# EAGLE design rgb-matrix-backpack-5 (EAGLE 6.5.0)

## Sheet 1 of 3
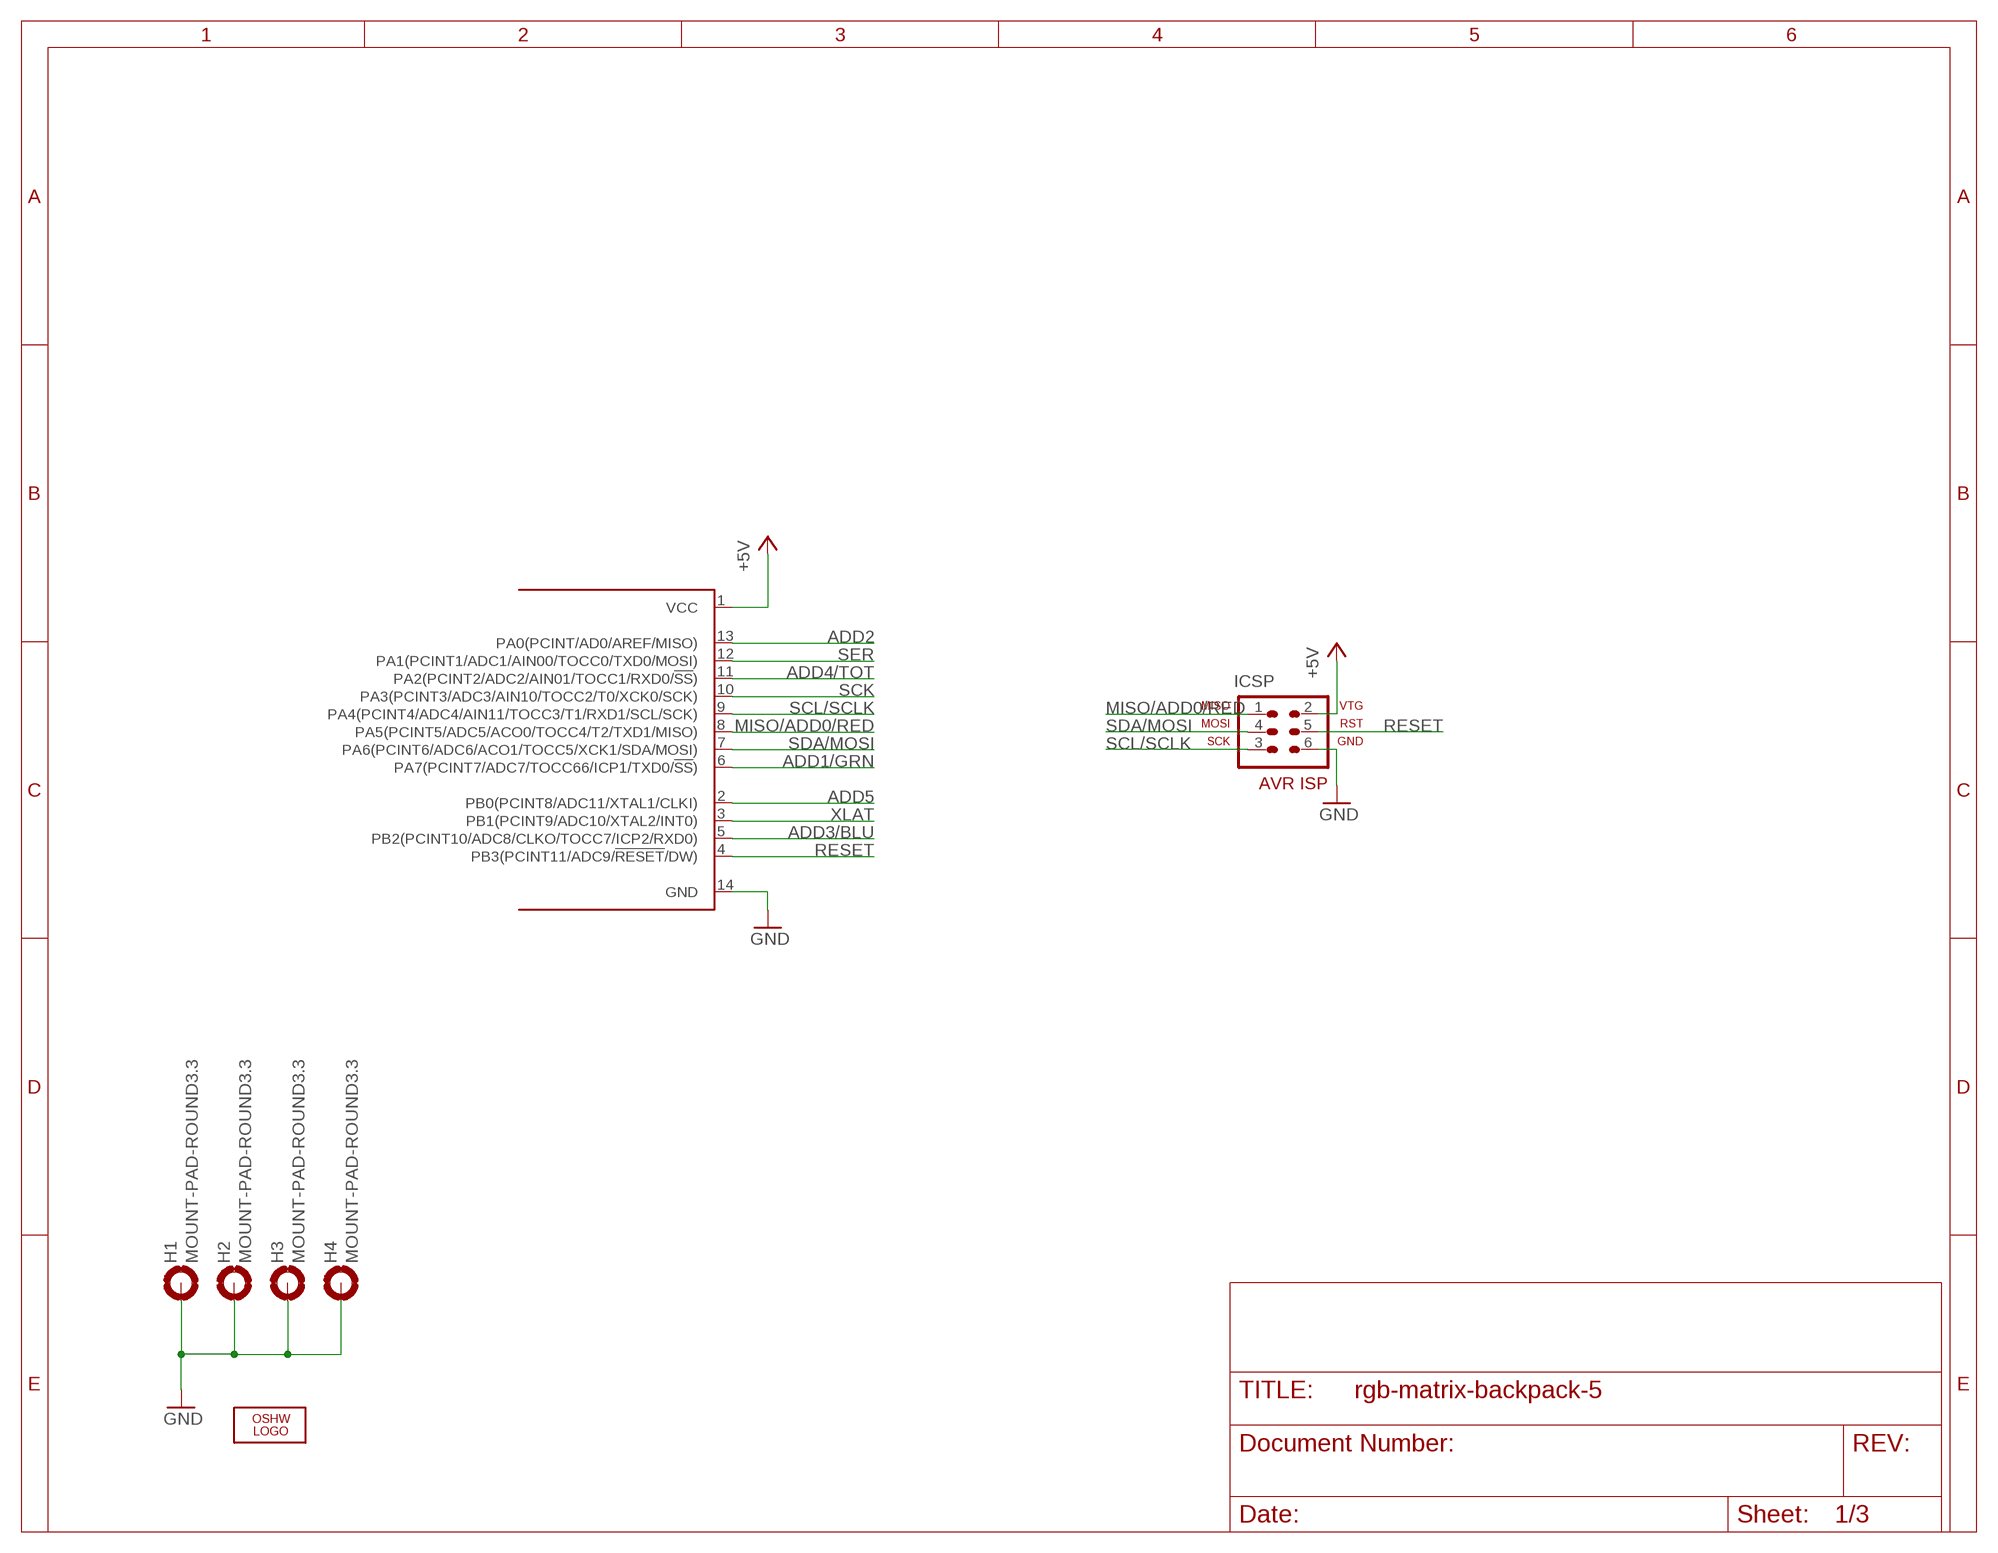
[diagram p0: schematic, sheet 1]

### Parts
H1  MOUNT-PAD-ROUND3.3  [3,3-PAD]
H2  MOUNT-PAD-ROUND3.3  [3,3-PAD]
H3  MOUNT-PAD-ROUND3.3  [3,3-PAD]
H4  MOUNT-PAD-ROUND3.3  [3,3-PAD]
ICSP  AVR-ISP-6  [AVR-ISP-6]
LOGO1  OSHW_LOGO_FILLX0350-NT  [OSHW_FILLX350_NOTEXT]
U1  ATTINY841-SU  [SO14]

### Nets
ADD1/GRN: U1.6(PA7(PCINT7/ADC7/TOCC66/ICP1/TXD0/!SS!)) ; also sheet 2,3
ADD2: U1.13(PA0(PCINT/AD0/AREF/MISO)) ; also sheet 2
ADD3/BLU: U1.5(PB2(PCINT10/ADC8/CLKO/TOCC7/ICP2/RXD0)) ; also sheet 2,3
ADD4/TOT: U1.11(PA2(PCINT2/ADC2/AIN01/TOCC1/RXD0/!SS!)) ; also sheet 2,3
ADD5: U1.2(PB0(PCINT8/ADC11/XTAL1/CLKI)) ; also sheet 2
GND [power]: H1.B3,3(MOUNT) H2.B3,3(MOUNT) H3.B3,3(MOUNT) H4.B3,3(MOUNT) ICSP.6 U1.14(GND) ; also sheet 2
MISO/ADD0/RED: ICSP.1 U1.8(PA5(PCINT5/ADC5/ACO0/TOCC4/T2/TXD1/MISO)) ; also sheet 2,3
RESET: ICSP.5 U1.4(PB3(PCINT11/ADC9/!RESET!/DW))
SCK: U1.10(PA3(PCINT3/ADC3/AIN10/TOCC2/T0/XCK0/SCK)) ; also sheet 3
SCL/SCLK: ICSP.3 U1.9(PA4(PCINT4/ADC4/AIN11/TOCC3/T1/RXD1/SCL/SCK)) ; also sheet 2
SDA/MOSI: ICSP.4 U1.7(PA6(PCINT6/ADC6/ACO1/TOCC5/XCK1/SDA/MOSI)) ; also sheet 2
SER: U1.12(PA1(PCINT1/ADC1/AIN00/TOCC0/TXD0/MOSI)) ; also sheet 3
VCC [power]: ICSP.2 U1.1(VCC) ; supply symbol labelled +5V ; also sheet 2,3
XLAT: U1.3(PB1(PCINT9/ADC10/XTAL2/INT0)) ; also sheet 3

## Sheet 2 of 3
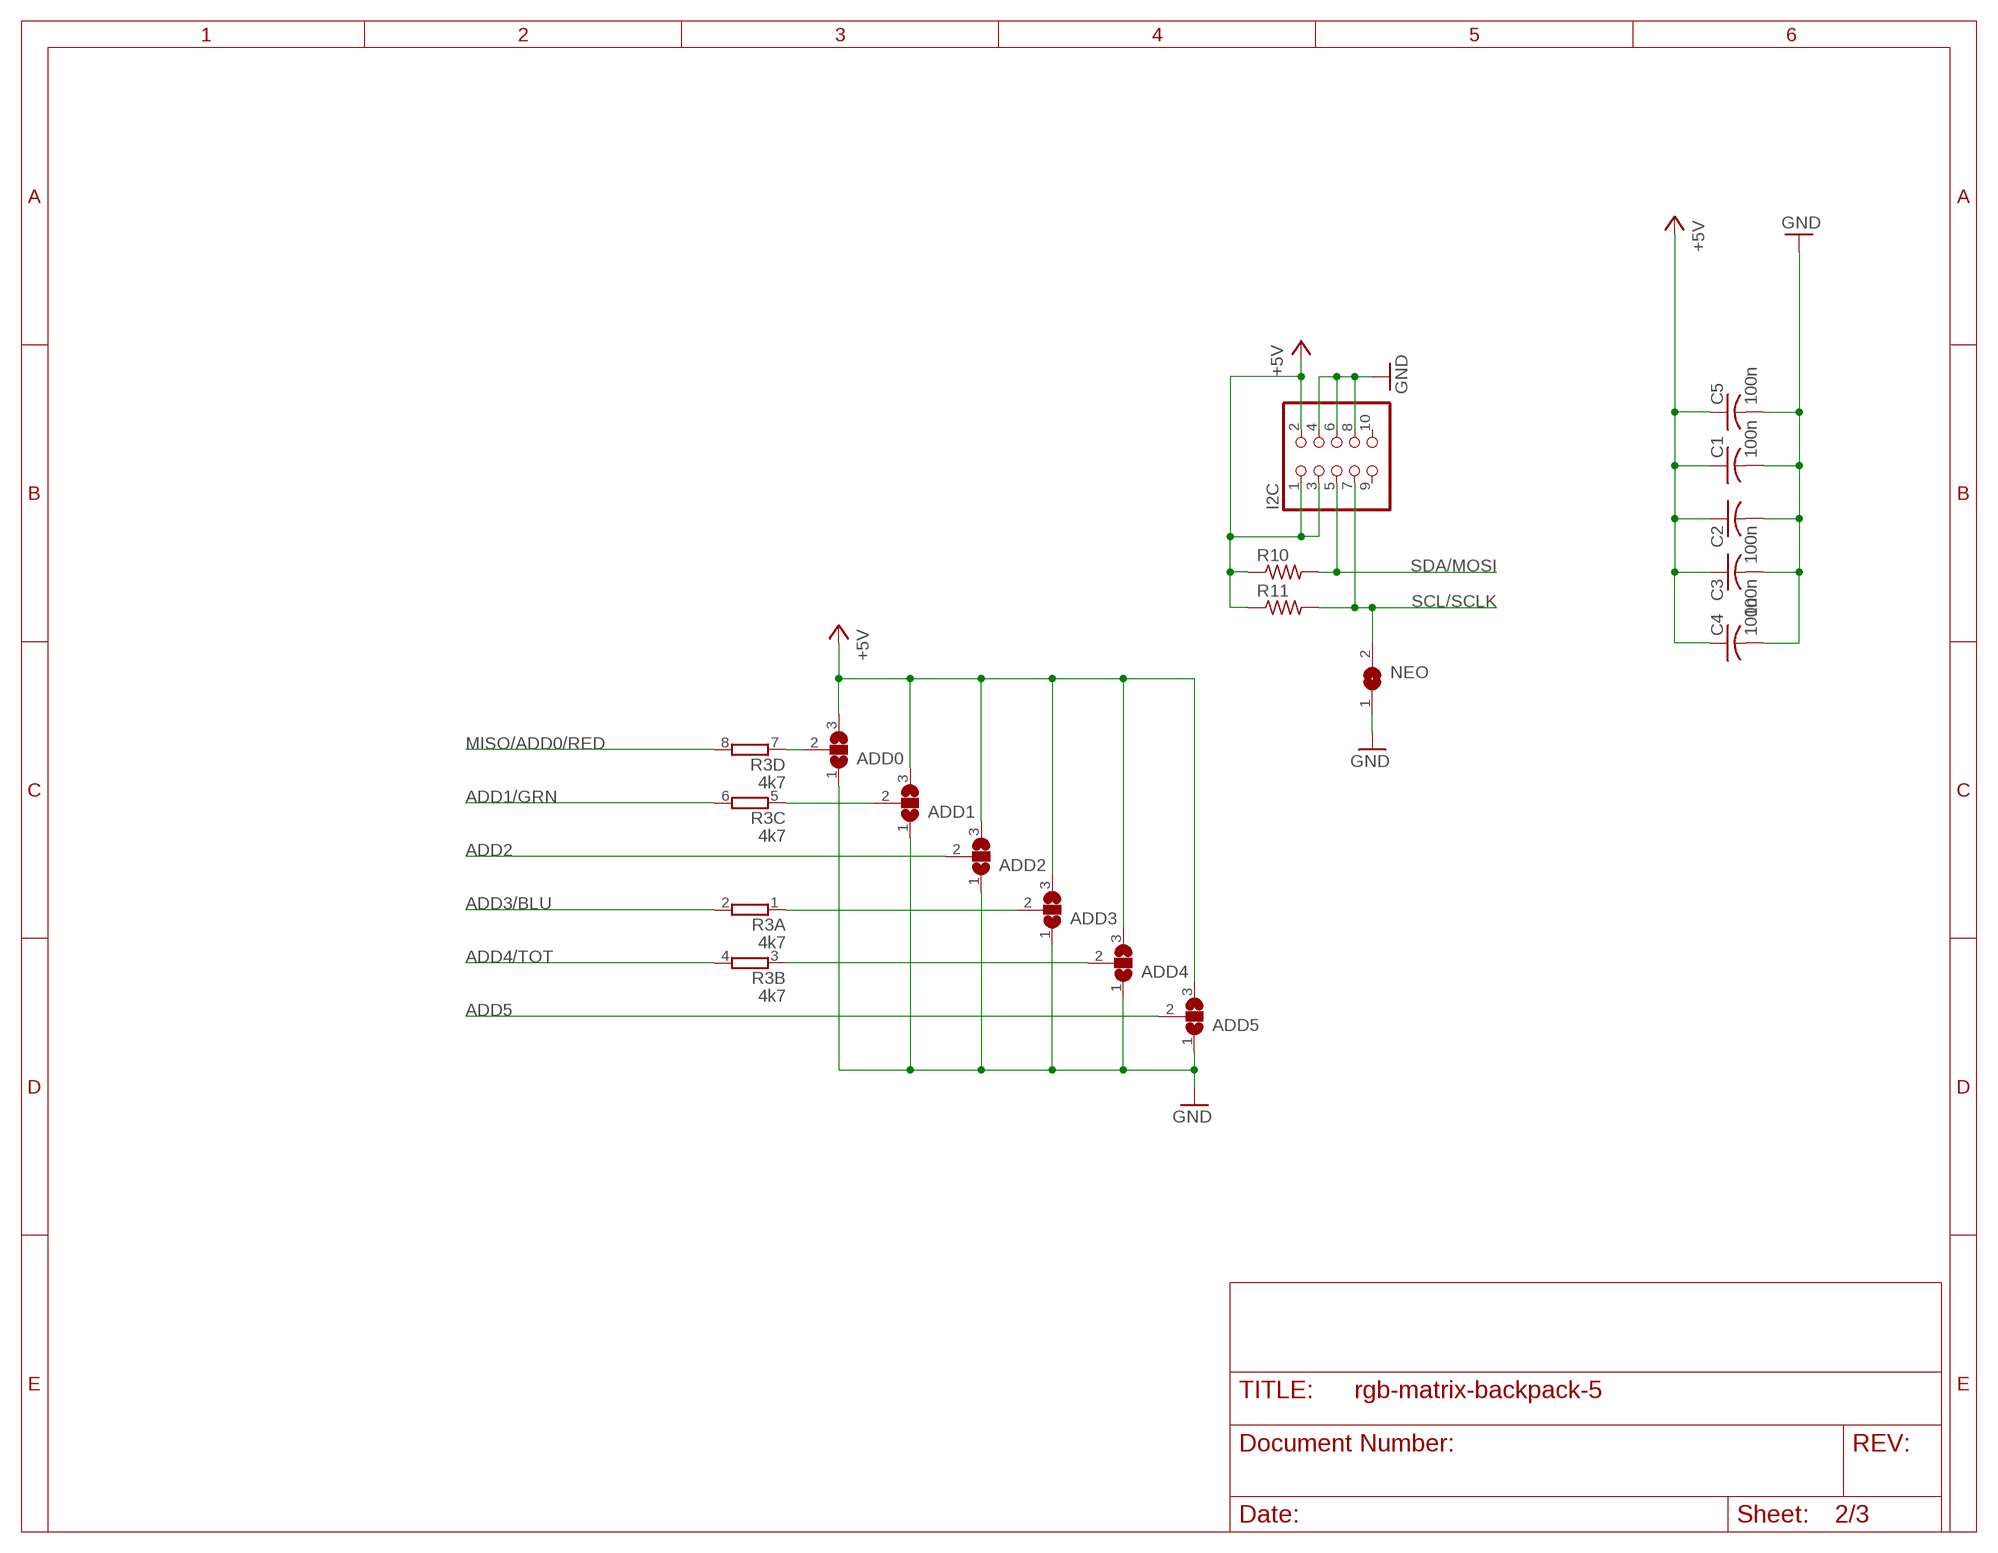
[diagram p1: schematic, sheet 2]

### Parts
ADD0  SJ2W  [SJ_2]
ADD1  SJ2W  [SJ_2]
ADD2  SJ2W  [SJ_2]
ADD3  SJ2W  [SJ_2]
ADD4  SJ2W  [SJ_2]
ADD5  SJ2W  [SJ_2]
C1  100n  C-USC0603  [C0603]
C2  100n  C-USC0603  [C0603]
C3  100n  C-USC0603  [C0603]
C4  100n  C-USC0603  [C0603]
C5  100n  C-USC0603  [C0603]
I2C  PINHD-2X5_2.54-90°  [2X05/90]
NEO  SJ  [SJ]
R3  4k7  4R-NCTS742C083  [CTS742C083-RES]
R10  R-US_0207/2V  [0207/2V]
R11  R-US_0207/2V  [0207/2V]

### Nets
ADD1/GRN: R3.6 ; also sheet 1,3
ADD2: ADD2.2 ; also sheet 1
ADD3/BLU: R3.2 ; also sheet 1,3
ADD4/TOT: R3.4 ; also sheet 1,3
ADD5: ADD5.2 ; also sheet 1
GND [power]: ADD0.1 ADD1.1 ADD2.1 ADD3.1 ADD4.1 ADD5.1 C1.2 C2.2 C3.2 C4.2 C5.2 I2C.4 I2C.6 I2C.8 NEO.1 ; also sheet 1
MISO/ADD0/RED: R3.8 ; also sheet 1,3
N$76: ADD3.2 R3.1
N$78: ADD0.2 R3.7
N$79: ADD1.2 R3.5
N$80: ADD4.2 R3.3
SCL/SCLK: I2C.7 NEO.2 R11.2 ; also sheet 1
SDA/MOSI: I2C.5 R10.2 ; also sheet 1
VCC [power]: ADD0.3 ADD1.3 ADD2.3 ADD3.3 ADD4.3 ADD5.3 C1.1 C2.1 C3.1 C4.1 C5.1 I2C.1 I2C.2 I2C.3 R10.1 R11.1 ; supply symbol labelled +5V ; also sheet 1,3
Unconnected: I2C.9 I2C.10

## Sheet 3 of 3
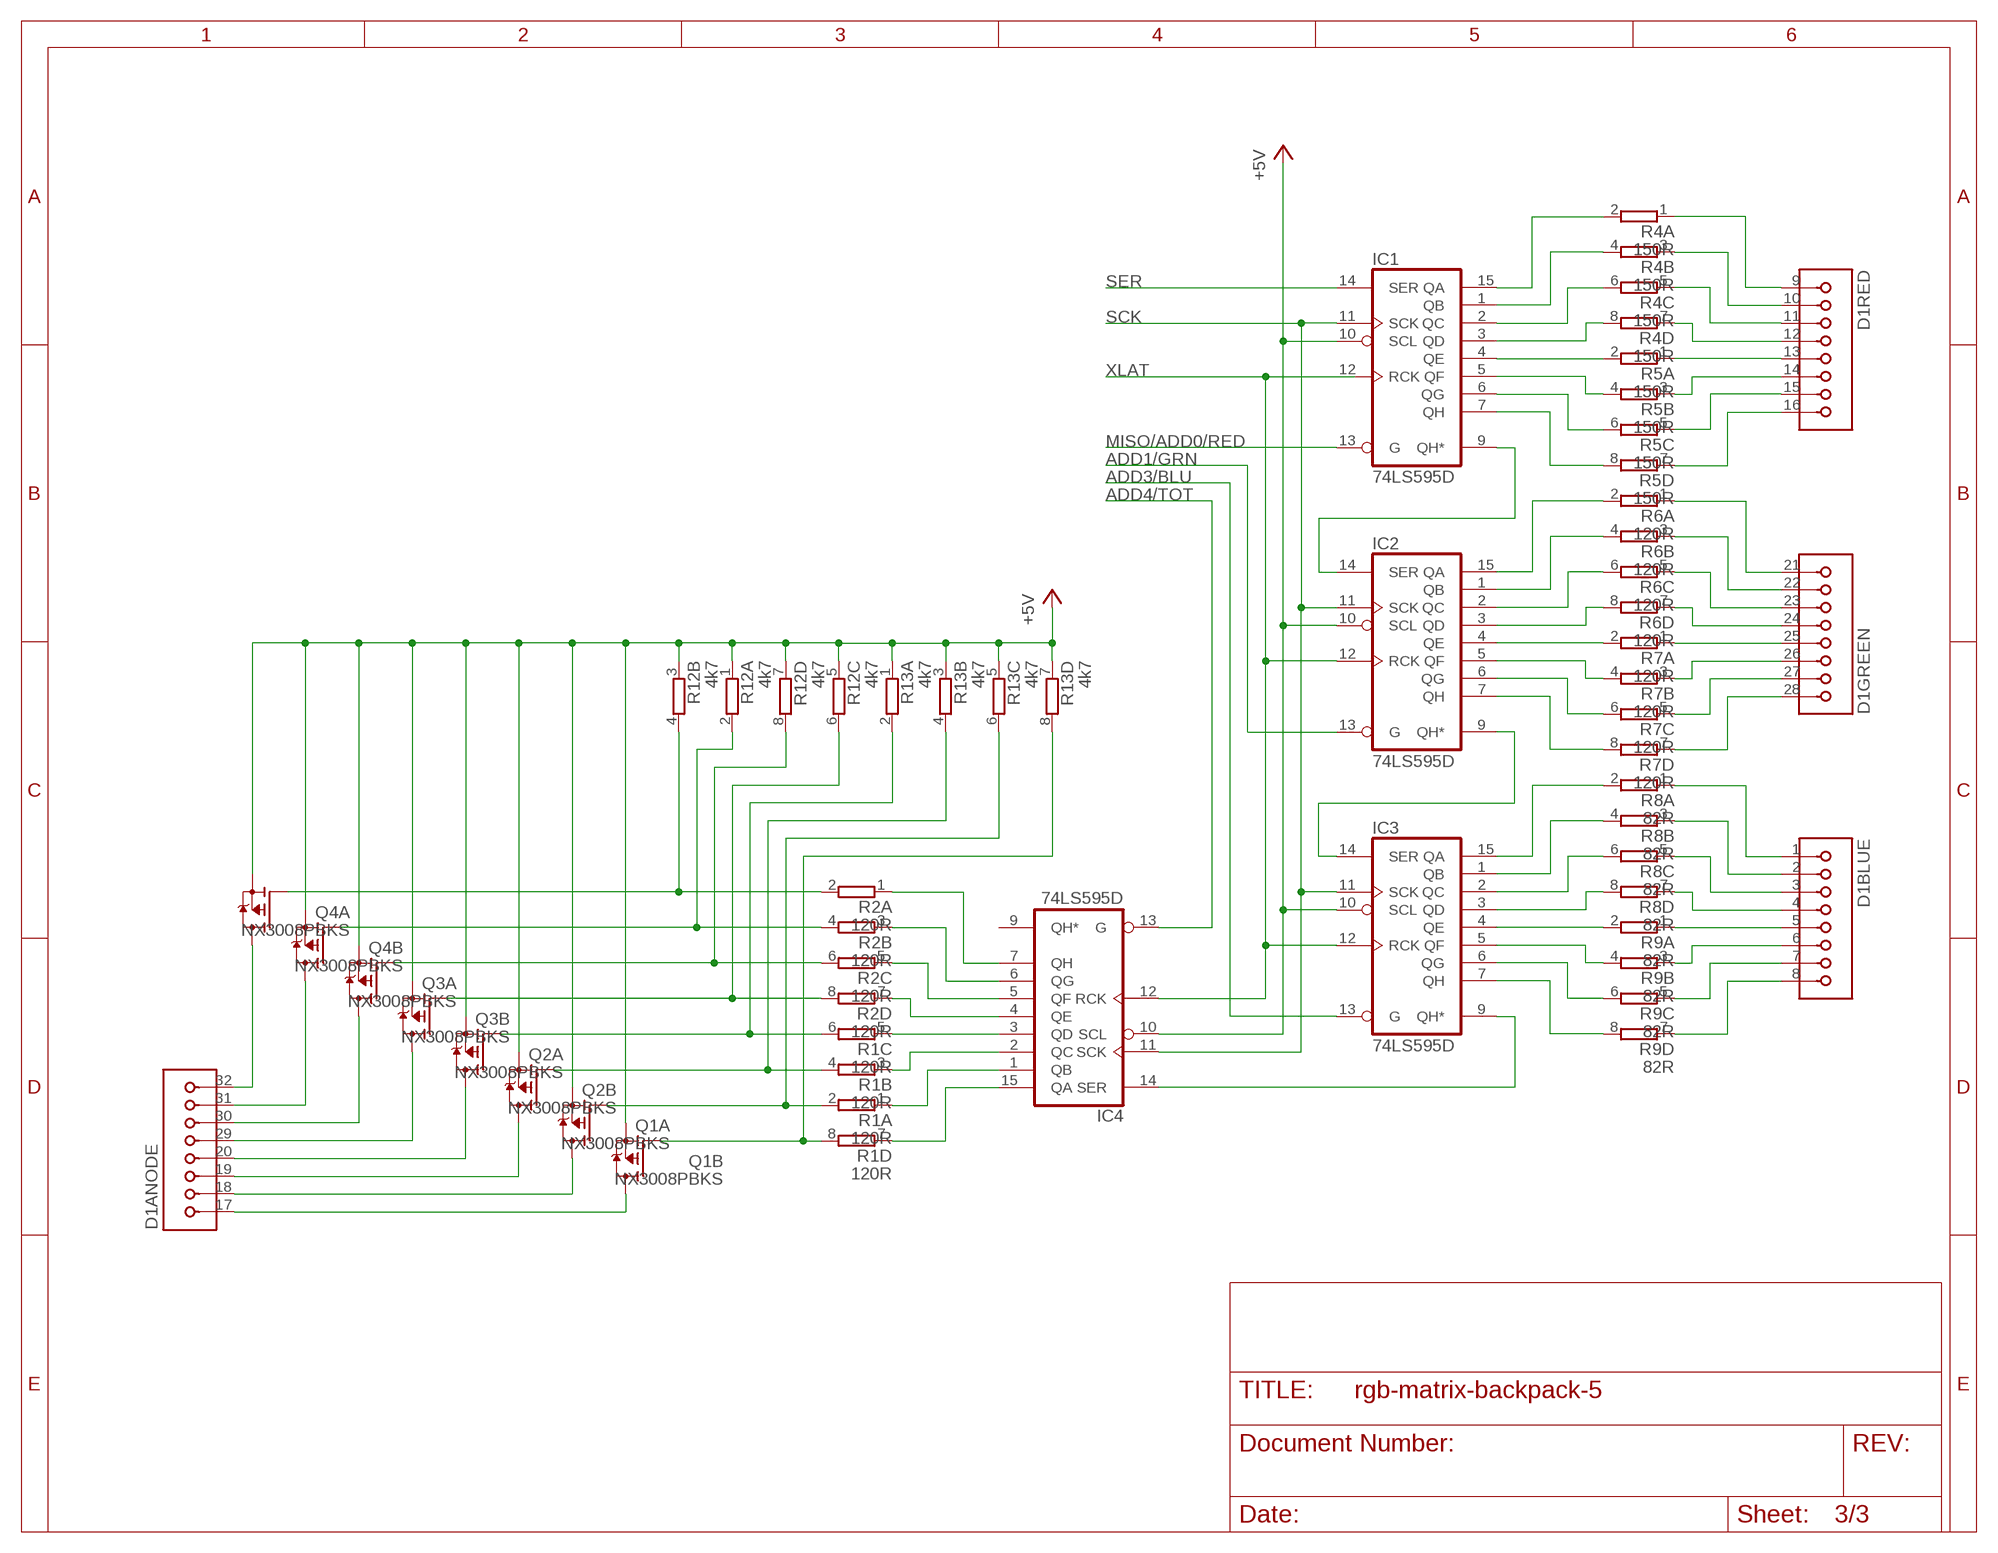
[diagram p2: schematic, sheet 3]

### Parts
D1  60MM-8X8-RGB-LED-ARRAY  [60MM-8X8-RGB-MATRIX]
IC1  74LS595D  [SO16]
IC2  74LS595D  [SO16]
IC3  74LS595D  [SO16]
IC4  74LS595D  [SO16]
Q1  NX3008PBKS  BSD223P  [SOT363_INFINEON]
Q2  NX3008PBKS  BSD223P  [SOT363_INFINEON]
Q3  NX3008PBKS  BSD223P  [SOT363_INFINEON]
Q4  NX3008PBKS  BSD223P  [SOT363_INFINEON]
R1  120R  4R-NCTS742C083  [CTS742C083-RES]
R2  120R  4R-NCTS742C083  [CTS742C083-RES]
R4  150R  4R-NCTS742C083  [CTS742C083-RES]
R5  150R  4R-NCTS742C083  [CTS742C083-RES]
R6  120R  4R-NCTS742C083  [CTS742C083-RES]
R7  120R  4R-NCTS742C083  [CTS742C083-RES]
R8  82R  4R-NCTS742C083  [CTS742C083-RES]
R9  82R  4R-NCTS742C083  [CTS742C083-RES]
R12  4k7  4R-NCTS742C083  [CTS742C083-RES]
R13  4k7  4R-NCTS742C083  [CTS742C083-RES]

### Nets
ADD1/GRN: IC2.13(G) ; also sheet 1,2
ADD3/BLU: IC3.13(G) ; also sheet 1,2
ADD4/TOT: IC4.13(G) ; also sheet 1,2
MISO/ADD0/RED: IC1.13(G) ; also sheet 1,2
N$1: D1.9 R4.1
N$2: D1.10 R4.3
N$3: D1.11 R4.5
N$4: D1.12 R4.7
N$5: D1.13 R5.1
N$6: D1.14 R5.3
N$7: D1.15 R5.5
N$8: D1.16 R5.7
N$9: D1.1 R8.1
N$10: D1.2 R8.3
N$11: D1.3 R8.5
N$12: D1.4 R8.7
N$13: D1.5 R9.1
N$14: D1.6 R9.3
N$15: D1.7 R9.5
N$16: D1.8 R9.7
N$17: D1.21 R6.1
N$18: D1.22 R6.3
N$19: D1.23 R6.5
N$20: D1.24 R6.7
N$21: D1.25 R7.1
N$22: D1.26 R7.3
N$23: D1.27 R7.5
N$24: D1.28 R7.7
N$25: IC3.9(QH*) IC4.14(SER)
N$26: IC1.15(QA) R4.2
N$27: IC1.2(QC) R4.6
N$28: IC1.4(QE) R5.2
N$29: IC1.6(QG) R5.6
N$30: IC2.15(QA) R6.2
N$31: IC2.2(QC) R6.6
N$32: IC2.4(QE) R7.2
N$33: IC2.6(QG) R7.6
N$34: IC3.1(QB) R8.4
N$35: IC3.3(QD) R8.8
N$36: IC3.5(QF) R9.4
N$37: IC3.7(QH) R9.8
N$38: IC1.3(QD) R4.8
N$39: IC1.5(QF) R5.4
N$40: IC2.1(QB) R6.4
N$41: IC2.3(QD) R6.8
N$42: IC2.5(QF) R7.4
N$43: IC2.7(QH) R7.8
N$44: IC3.15(QA) R8.2
N$45: IC3.2(QC) R8.6
N$46: IC3.4(QE) R9.2
N$47: IC3.6(QG) R9.6
N$48: IC4.15(QA) R1.7
N$49: IC4.1(QB) R1.1
N$50: IC4.2(QC) R1.3
N$51: IC4.3(QD) R1.5
N$52: Q1.5(B:G) R1.8 R13.8
N$53: IC1.7(QH) R5.8
N$54: Q1.2(A:G) R1.2 R13.6
N$55: IC1.9(QH*) IC2.14(SER)
N$56: IC2.9(QH*) IC3.14(SER)
N$57: Q2.2(A:G) R1.6 R13.2
N$58: Q2.5(B:G) R1.4 R13.4
N$59: IC1.1(QB) R4.4
N$60: D1.20 Q2.6(A:D)
N$61: D1.19 Q2.3(B:D)
N$62: D1.18 Q1.6(A:D)
N$63: D1.17 Q1.3(B:D)
N$64: D1.29 Q3.3(B:D)
N$65: D1.30 Q3.6(A:D)
N$66: D1.31 Q4.3(B:D)
N$67: D1.32 Q4.6(A:D)
N$68: IC4.4(QE) R2.7
N$69: IC4.5(QF) R2.5
N$70: IC4.6(QG) R2.3
N$71: IC4.7(QH) R2.1
N$72: Q4.2(A:G) R2.2 R12.4
N$73: Q4.5(B:G) R2.4 R12.2
N$74: Q3.2(A:G) R2.6 R12.8
N$75: Q3.5(B:G) R2.8 R12.6
SCK: IC1.11(SCK) IC2.11(SCK) IC3.11(SCK) IC4.11(SCK) ; also sheet 1
SER: IC1.14(SER) ; also sheet 1
VCC [power]: IC1.10(SCL) IC2.10(SCL) IC3.10(SCL) IC4.10(SCL) Q1.1(A:S) Q1.4(B:S) Q2.1(A:S) Q2.4(B:S) Q3.1(A:S) Q3.4(B:S) Q4.1(A:S) Q4.4(B:S) R12.1 R12.3 R12.5 R12.7 R13.1 R13.3 R13.5 R13.7 ; supply symbol labelled +5V ; also sheet 1,2
XLAT: IC1.12(RCK) IC2.12(RCK) IC3.12(RCK) IC4.12(RCK) ; also sheet 1
Unconnected: IC4.9(QH*)

## Power pins joined to a net without a drawn wire
GND: IC1.8(GND) IC2.8(GND) IC3.8(GND) IC4.8(GND)
VCC: IC1.16(VCC) IC2.16(VCC) IC3.16(VCC) IC4.16(VCC)

## Library data of the parts
ADD0 ADD1-ADD5 = jumper:SJ2W: SMD solder JUMPER; BOM: EXCLUDE
C1 C2 C4 C5 = resistor:C-US: CAPACITOR, American symbol; PARTNO: CC0603MRY5V9BB104
C3 = resistor:C-US: CAPACITOR, American symbol; PARTNO: CC0603ZRY5V7BB105
D1 = logos-diodes:60MM-8X8-RGB-LED-ARRAY; BOM: EXCLUDE; DNP: T
H1-H4 = holes:MOUNT-PAD-ROUND: MOUNTING PAD, round; BOM: EXCLUDE
I2C = pinhead-1:PINHD-2X5: PIN HEADER; BOM: EXCLUDE; DNP: T
IC1-IC4 = 74xx-us:74*595: 8-bit SHIFT REGISTER, output latch
ICSP = avr-4:AVR-ISP-6: AVR ISP-6 Serial Programming Header; BOM: EXCLUDE
LOGO1 = OSHW:OSHW_LOGO_FILL; BOM: EXCLUDE
NEO = jumper:SJ: SMD solder JUMPER
Q1 = transistor-fet:BSD223P: OptiMOS(R)-P Small-Signal-Transistor Dual P-Channel, Enhancement mode, Super Logic Level (2.5 V rated) Source: http://www.infineon.com/upload/Document/BSD223P_Rev1.3.pdf; PARTNO: NX3008PBKS
Q2-Q4 = transistor-fet:BSD223P: OptiMOS(R)-P Small-Signal-Transistor Dual P-Channel, Enhancement mode, Super Logic Level (2.5 V rated) Source: http://www.infineon.com/upload/Document/BSD223P_Rev1.3.pdf
R1-R9 R12 R13 = res-cap-arrays:4R-N: Array Chip Resistor Source: RS Component / Phycomp; PARTNO: 742C083102JPTR
R10 R11 = resistor:R-US_: RESISTOR, American symbol; DNP: T; PARTNO: CF14JT4K70
U1 = ATTINY841:ATTINY841

## Board
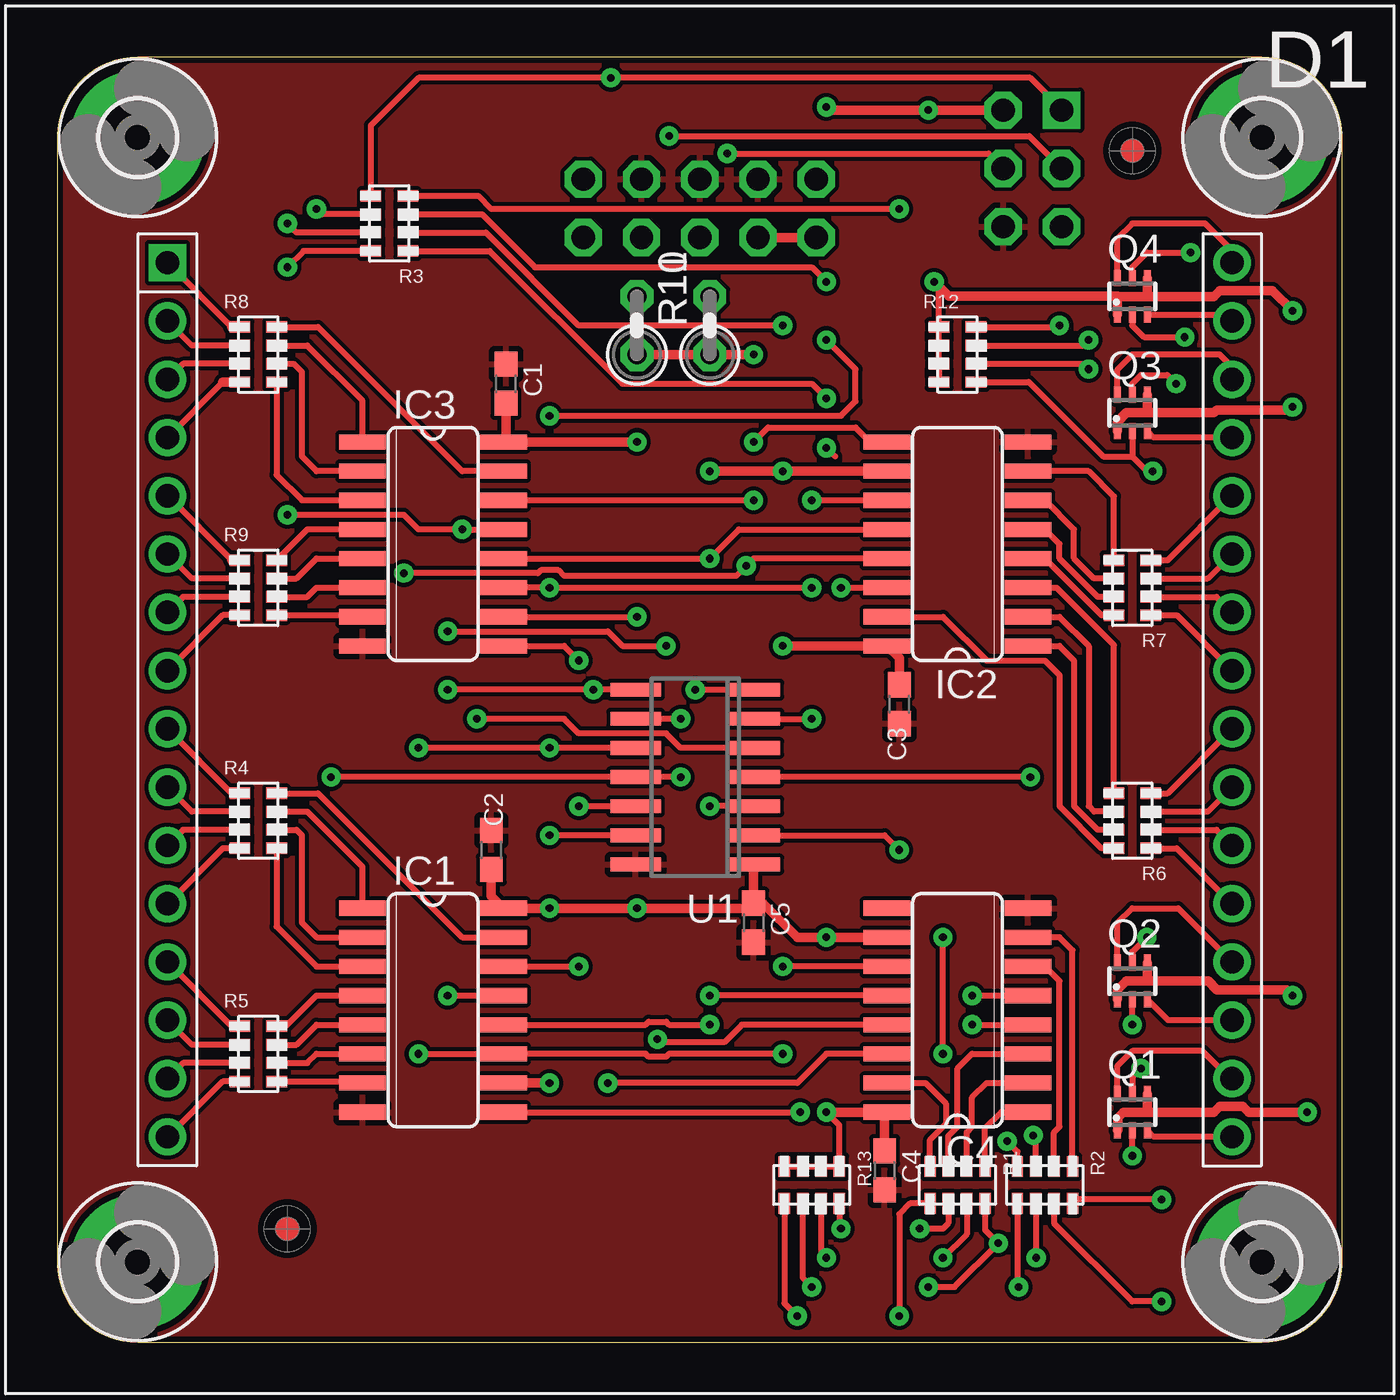
[diagram p3: board, top side]
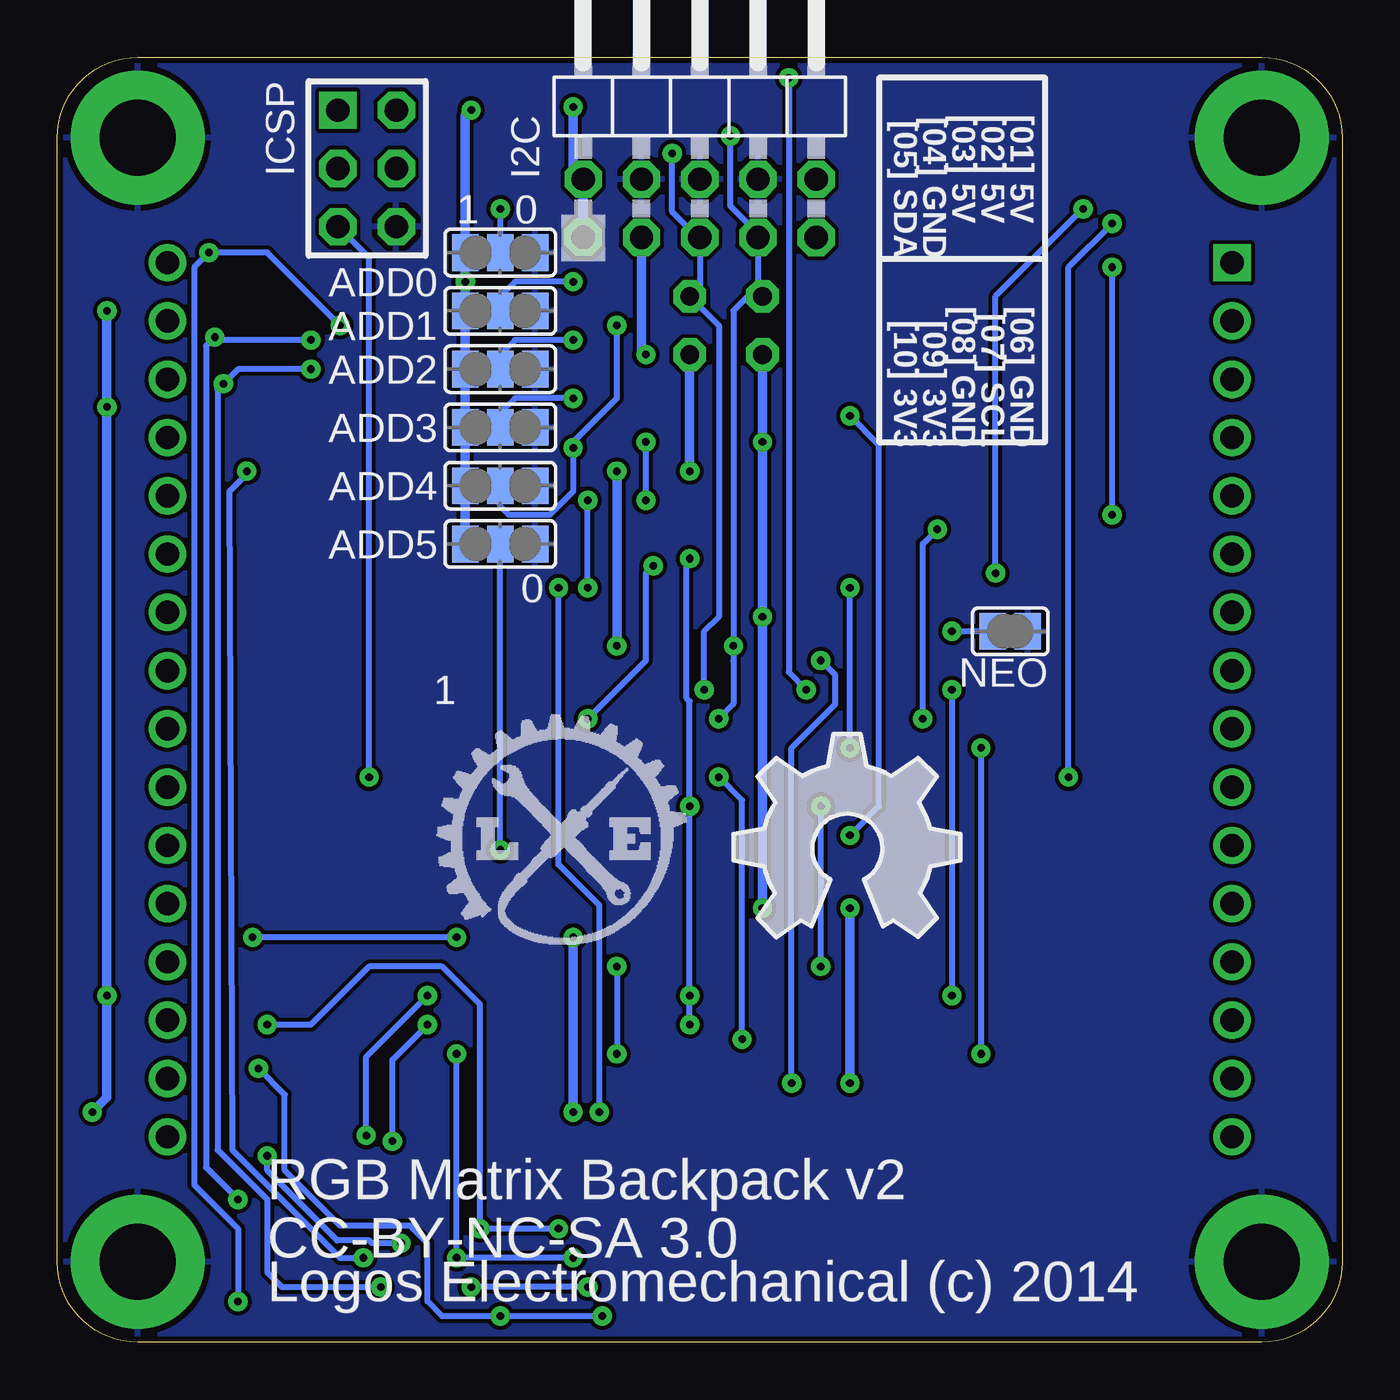
[diagram p4: board, bottom side, seen from below]

Size 56 x 56 mm. Coordinates in mm from the lower left corner, seen from the top.
Outline: 0,52.51 0,3.49 arc90 3.49,0 52.51,0 arc90 56,3.49 56,52.51 arc90 52.51,56 3.49,56 arc90 0,52.51
Copper layers (1*16): Top 0.035559375mm / dielectric 1.501140625mm / Bottom 0.035559375mm
Design rules "default *": minimum track width 7mil, minimum drill 13mil, track to track 7mil, track to pad 7mil, pad to pad 7mil, via to via 7mil, smd to smd 0mil, copper to edge 10mil, drill to drill 8mil, minimum pad ring 12mil, minimum via ring 10mil, stop-mask expansion 0mil, vias tented up to drill 50mil, thermal gap 10mil
tRestrict: area 8.8,3.7 to 11.3,6.2; area 45.6,50.7 to 48.1,53.2
Milling: 4 lines

### Footprints (pad centres in the part's own frame; a part is rotated, then mirrored left to right if it is on the bottom)
SJ_2 = smd 1.168 x 1.6: 1 -1.524,0; 2 0,0; 3 1.524,0
C0603 = smd 1.1 x 1: 1 -0.85,0; 2 0.85,0
60MM-8X8-RGB-MATRIX = drill 1.016 square: 1 -23.2,19.05 | drill 1.016: 2 -23.2,16.51; 3 -23.2,13.97; 4 -23.2,11.43; 5 -23.2,8.89; 6 -23.2,6.35; 7 -23.2,3.81; 8 -23.2,1.27; 9 -23.2,-1.27; 10 -23.2,-3.81; 11 -23.2,-6.35; 12 -23.2,-8.89; 13 -23.2,-11.43; 14 -23.2,-13.97; 15 -23.2,-16.51; 16 -23.2,-19.05; 17 23.2,-19.05; 18 23.2,-16.51; 19 23.2,-13.97; 20 23.2,-11.43; 21 23.2,-8.89; 22 23.2,-6.35; 23 23.2,-3.81; 24 23.2,-1.27; 25 23.2,1.27; 26 23.2,3.81; 27 23.2,6.35; 28 23.2,8.89; 29 23.2,11.43; 30 23.2,13.97; 31 23.2,16.51; 32 23.2,19.05
3,3-PAD = drill 3.3 pad 5.842: B3,3 0,0
2X05/90 = drill 1.016 octagon: 1 -5.08,-6.35; 2 -5.08,-3.81; 3 -2.54,-6.35; 4 -2.54,-3.81; 5 0,-6.35; 6 0,-3.81; 7 2.54,-6.35; 8 2.54,-3.81; 9 5.08,-6.35; 10 5.08,-3.81
SO16 = smd 0.66 x 2.032: 1 -4.445,-3.073; 2 -3.175,-3.073; 3 -1.905,-3.073; 4 -0.635,-3.073; 5 0.635,-3.073; 6 1.905,-3.073; 7 3.175,-3.073; 8 4.445,-3.073; 9 4.445,3.073; 10 3.175,3.073; 11 1.905,3.073; 12 0.635,3.073; 13 -0.635,3.073; 14 -1.905,3.073; 15 -3.175,3.073; 16 -4.445,3.073
AVR-ISP-6 = drill 1.016 square: 1 -2.54,-1.27 | drill 1.016 octagon: 2 -2.54,1.27; 3 0,-1.27; 4 0,1.27; 5 2.54,-1.27; 6 2.54,1.27
SJ = smd 1.168 x 1.6: 1 -0.762,0; 2 0.762,0
SOT363_INFINEON = smd 0.3 x 0.7: 1 -0.65,-0.8; 2 0,-0.8; 3 0.65,-0.8; 4 0.65,0.8; 5 0,0.8; 6 -0.65,0.8
CTS742C083-RES = smd 0.9 x 0.5: 1 -0.8,1.2; 2 0.8,1.2; 3 -0.8,0.4; 4 0.8,0.4; 5 -0.8,-0.4; 6 0.8,-0.4; 7 -0.8,-1.2; 8 0.8,-1.2
0207/2V = drill 0.813 octagon: 1 -1.27,0; 2 1.27,0
SO14 = smd 0.6 x 2.2: 1 -3.81,-2.6; 2 -2.54,-2.6; 3 -1.27,-2.6; 4 0,-2.6; 5 1.27,-2.6; 6 2.54,-2.6; 7 3.81,-2.6; 8 3.81,2.6; 9 2.54,2.6; 10 1.27,2.6; 11 0,2.6; 12 -1.27,2.6; 13 -2.54,2.6; 14 -3.81,2.6

### Placement (x,y rotation side)
ADD0  36.7,47.49 180 bottom
ADD1  36.7,44.95 180 bottom
ADD2  36.7,42.41 180 bottom
ADD3  36.7,39.87 180 bottom
ADD4  36.7,37.33 180 bottom
ADD5  36.7,34.79 180 bottom
C1  19.55,41.77 90 top
C2  18.91,21.45 90 top
C3  36.7,27.8 270 top
C4  36.06,7.49 270 top
C5  30.34,18.28 270 top
D1  28,28 0 top
H1  3.5,52.5 0 top
H2  3.5,3.5 0 top
H3  52.5,3.5 0 top
H4  52.5,52.5 0 top
I2C  28,54.5 0 bottom
IC1  16.38,14.47 270 top
IC2  39.23,34.79 90 top
IC3  16.38,34.79 270 top
IC4  39.23,14.47 90 top
ICSP  42.5,51.16 270 bottom
LOGO1  26.54,17.64 0 bottom
NEO  14.47,30.98 180 bottom
Q1  46.85,10.03 0 top
Q2  46.85,15.74 0 top
Q3  46.85,40.51 0 top
Q4  46.85,45.59 0 top
R1  39.23,6.85 270 top
R2  43.05,6.85 270 top
R3  14.47,48.76 180 top
R4  8.76,22.73 0 top
R5  8.76,12.56 0 top
R6  46.85,22.73 180 top
R7  46.85,32.88 180 top
R8  8.76,43.05 0 top
R9  8.76,32.88 0 top
R10  28.44,44.31 90 top
R11  25.27,44.31 90 top
R12  39.23,43.05 0 top
R13  32.88,6.85 270 top
U1  27.8,24.63 90 top
U$1  [LOGO-SM]  39.87,17.01 0 bottom
U$4  [FIDUCIAL_G10]  46.85,51.94 0 top
U$5  [FIDUCIAL_G10]  10.03,4.95 0 top

### Tracks (layer width: path | path; a pad name or v marks a point on that pad's centre or on a via)
ADD1/GRN  (via drill 0.33)
  Top 0.254: IC2.13 30.34,34.16 v30.03,33.84 29.58,33.39 22.09,33.39 21.84,33.65 21.07,33.65 20.95,33.52 v15.11,33.52 | R3.6 11.53,49.16 v11.29,49.4 | U1.6 v32.88,27.17
  Bottom 0.254: v15.11,33.52 15.11,45.59 v11.29,49.4 | v32.88,27.17 30.34,29.71 30.34,33.52 v30.03,33.84
ADD2  (via drill 0.33)
  Top 0.254: U1.13 v21.45,22.09 | v21.45,40.38 34.16,40.38 34.79,41.01 34.79,42.41 v33.52,43.68
  Bottom 0.254: v21.45,22.09 20.18,23.36 20.18,39.11 v21.45,40.38 | v33.52,43.68 36.06,43.68 36.7,43.05 ADD2.2
ADD3/BLU  (via drill 0.33)
  Top 0.254: U1.5 27.17,25.9 26.54,26.54 22.73,26.54 22.09,27.17 v18.28,27.17 | IC3.13 v17.64,35.42 15.74,35.42 15.11,36.06 v10.03,36.06 | R3.2 10.73,47.56 v10.03,46.85
  Bottom 0.254: v18.28,27.17 18.28,34.79 v17.64,35.42 | v10.03,36.06 v10.03,46.85
ADD4/TOT  (via drill 0.33)
  Top 0.254: IC4.13 29.84,13.84 29.07,13.07 26.28,13.07 v26.15,13.2 | v27.17,24.63 U1.11 v11.93,24.63 | R3.4 10.43,48.36 v10.03,48.76
  Bottom 0.254: v26.15,13.2 26.15,23.61 v27.17,24.63 | v11.93,24.63 11.93,46.85 v10.03,48.76
ADD5  (via drill 0.33)
  Top 0.254: U1.2 36.06,22.09 v36.7,21.45
  Bottom 0.254: v36.7,21.45 ADD5.2
GND
  pour Top: 0,52.51 0,3.49 arc90 3.49,0 52.51,0 arc90 56,3.49 56,52.51 arc90 52.51,56 3.49,56 arc90
  pour Bottom: 0,52.51 0,3.49 arc90 3.49,0 52.51,0 arc90 56,3.49 56,52.51 arc90 52.51,56 3.49,56 arc90
MISO/ADD0/RED  (via drill 0.33)
  Top 0.254: ICSP.1 43.77,53.75 42.41,55.11 v24.12,55.11 15.74,55.11 13.67,53.04 R3.8 | U1.8 v23.36,28.44 v17.01,28.44 | v17.01,15.11 IC1.13
  Bottom 0.254: v24.12,55.11 24.12,29.2 v23.36,28.44 | v17.01,28.44 v17.01,15.11
N$1
  Top 0.254: R4.1 7.61,23.93 D1.9
N$2
  Top 0.254: R4.3 5.87,23.12 D1.10
N$3
  Top 0.254: R4.5 5.47,22.32 D1.11
N$4
  Top 0.254: R4.7 7.21,21.52 D1.12
N$5
  Top 0.254: R5.1 7.61,13.77 D1.13
N$6
  Top 0.254: R5.3 5.87,12.96 D1.14
N$7
  Top 0.254: R5.5 5.47,12.16 D1.15
N$8
  Top 0.254: R5.7 7.21,11.37 D1.16
N$9
  Top 0.254: 7.61,44.24 D1.1
  Top 0.406: R8.1 7.61,44.24
N$10
  Top 0.254: R8.3 5.87,43.45 D1.2
N$11
  Top 0.254: R8.5 5.47,42.65 D1.3
N$12
  Top 0.254: 7.21,41.84 D1.4
  Top 0.406: R8.7 7.21,41.84
N$13
  Top 0.254: 7.61,34.09 D1.5
  Top 0.406: R9.1 7.61,34.09
N$14
  Top 0.254: R9.3 5.87,33.28 D1.6
N$15
  Top 0.254: R9.5 5.47,32.48 D1.7
N$16
  Top 0.254: R9.7 7.21,31.68 D1.8
N$17
  Top 0.254: R6.1 48.78,21.52 D1.21
N$18
  Top 0.254: R6.3 50.52,22.32 D1.22
N$19
  Top 0.254: R6.5 50.13,23.12 D1.23
N$20
  Top 0.254: R6.7 48.4,23.93 D1.24
N$21
  Top 0.254: R7.1 48.78,31.68 D1.25
N$22
  Top 0.254: R7.3 50.52,32.48 D1.26
N$23
  Top 0.254: R7.5 50.13,33.28 D1.27
N$24
  Top 0.254: R7.7 48.4,34.09 D1.28
N$25  (via drill 0.33)
  Top 0.254: IC4.14 33.52,12.56 32.25,11.29 v24,11.29 | IC3.9 22.09,30.34 v22.73,29.71
  Bottom 0.254: v24,11.29 24,25.9 22.09,27.8 22.09,29.07 v22.73,29.71
N$26
  Top 0.254: R4.2 11.37,23.93 17.64,17.64 IC1.15
N$27
  Top 0.254: IC1.2 11.29,17.64 10.66,18.28 10.66,22.09 10.43,22.32 R4.6
N$28
  Top 0.254: R5.2 9.96,13.77 11.29,15.11 IC1.4
N$29
  Top 0.254: R5.6 10.89,12.16 11.29,12.56 IC1.6
N$30
  Top 0.254: IC2.15 38.6,31.61 40.51,29.71 43.05,29.71 43.68,29.07 43.68,23.36 45.52,21.52 R6.2
N$31
  Top 0.254: IC2.2 43.68,31.61 44.95,30.34 44.95,23.36 45.19,23.12 R6.6
N$32
  Top 0.254: IC2.4 43.05,34.16 45.52,31.68 R7.2
N$33
  Top 0.254: IC2.6 43.05,36.7 44.31,35.42 44.31,34.16 45.19,33.28 R7.6
N$34
  Top 0.254: R8.4 10.89,43.45 13.3,41.04 IC3.1
N$35
  Top 0.254: R8.8 9.55,37.8 10.66,36.7 IC3.3
N$36
  Top 0.254: R9.4 10.43,33.28 11.29,34.16 IC3.5
N$37
  Top 0.254: R9.8 12.6,31.68
  Top 0.406: 12.6,31.68 IC3.7
N$38
  Top 0.254: R4.8 9.55,18.11 11.29,16.38 IC1.3
N$39
  Top 0.254: R5.4 10.43,12.96 11.29,13.84 IC1.5
N$40
  Top 0.254: IC2.1 43.68,30.34 44.31,29.71 44.31,23.36 45.35,22.32 R6.4
N$41
  Top 0.254: IC2.3 43.55,32.88 46.05,30.38 R6.8
N$42
  Top 0.254: IC2.5 43.05,35.42 43.68,34.79 43.68,34.16 45.35,32.48 R7.4
N$43
  Top 0.254: R7.8 46.05,36.86 44.95,37.97 IC2.7
N$44
  Top 0.254: R8.2 11.37,44.24 17.64,37.97 IC3.15
N$45
  Top 0.254: IC3.2 11.29,37.97 10.66,38.6 10.66,42.28 10.3,42.65 R8.6
N$46
  Top 0.254: IC3.4 10.89,35.42 R9.2
N$47
  Top 0.254: R9.6 10.89,32.48 11.29,32.88 IC3.6
N$48
  Top 0.254: IC4.15 37.84,11.29 38.73,10.41 38.73,9.52 38.03,8.82 R1.7
N$49
  Top 0.254: R1.1 40.44,9.32 41.14,10.03 IC4.1
N$50
  Top 0.254: R1.3 39.63,9.15 39.87,9.39 39.87,10.66 40.51,11.29 IC4.2
N$51
  Top 0.254: R1.5 38.84,8.99 39.23,9.39 39.23,11.93 39.87,12.56 IC4.3
N$52  (via drill 0.33)
  Top 0.254: R1.8 37.16,6.05 36.7,5.58 v36.7,1.14 | v47.24,11.93 46.85,11.55 Q1.5 | R13.8 31.68,1.7 v32.25,1.14
  Bottom 0.254: v47.24,11.93 46.09,10.79 46.09,7.49 43.68,5.07 40.63,5.07 39.87,4.31 39.87,1.77 39.23,1.14 v36.7,1.14 v32.25,1.14
N$53
  Top 0.254: R5.8 12.6,11.37 IC1.7
N$54  (via drill 0.33)
  Top 0.254: R1.2 40.44,4.89 v41.01,4.31 39.11,2.41 v37.97,2.41 | v46.85,8.12 Q1.2 | R13.6 32.48,2.81 v32.88,2.41
  Bottom 0.254: v41.01,4.31 42.28,4.31 42.41,4.44 43.81,4.44 46.85,7.49 v46.85,8.12 | v32.88,2.41 v37.97,2.41
N$55  (via drill 0.33)
  Top 0.254: IC1.9 v32.38,10.03 | v34.16,32.88 IC2.14
  Bottom 0.254: v32.38,10.03 32.38,19.04 34.16,20.82 v34.16,32.88
N$56  (via drill 0.33)
  Top 0.254: IC3.14 v30.34,36.7 | v30.34,39.23 30.98,39.87 34.79,39.87 35.42,39.23 IC2.9
  Bottom 0.254: v30.34,36.7 v30.34,39.23
N$57  (via drill 0.33)
  Top 0.254: R1.6 38.84,5.18 38.6,4.95 v37.58,4.95 | v46.85,13.84 Q2.2 | R13.2 34.09,5.01 v34.16,4.95
  Bottom 0.254: v46.85,13.84 44.95,13.84 42.41,16.38 39.23,16.38 37.58,14.72 v37.58,4.95 v34.16,4.95
N$58  (via drill 0.33)
  Top 0.254: R1.4 39.63,4.71 v38.6,3.67 | v38.6,12.56 v38.6,17.64 | v47.49,17.64 46.85,17.01 Q2.5 | R13.4 33.28,3.91 v33.52,3.67
  Bottom 0.254: v38.6,12.56 v38.6,3.67 v33.52,3.67 | v38.6,17.64 v47.49,17.64
N$59
  Top 0.254: R4.4 10.89,23.12 13.3,20.72 IC1.1
N$60
  Top 0.254: Q2.6 46.2,18.27 46.85,18.91 48.85,18.91 D1.20
N$61
  Top 0.254: D1.19 48.41,14.03 Q2.3
N$62
  Top 0.254: D1.18 51.1,11.49 49.9,12.69 46.85,12.69 46.2,12.04 Q1.6
N$63
  Top 0.254: D1.17 47.78,8.95 Q1.3
N$64
  Top 0.254: D1.29 47.78,39.43 Q3.3
N$65
  Top 0.254: D1.30 51.2,42.51 50.66,43.05 46.85,43.05 46.2,42.4 Q3.6
N$66
  Top 0.254: Q4.3 50.92,44.78 D1.31
N$67
  Top 0.254: D1.32 51.2,47.59 50.03,48.76 46.85,48.76 46.2,48.11 Q4.6
N$68  (via drill 0.33)
  Top 0.254: R2.7 41.84,8.3 v41.39,8.76 | v39.87,13.84 IC4.4
  Bottom 0.254: v41.39,8.76 41.39,12.31 v39.87,13.84
N$69  (via drill 0.33)
  Top 0.254: R2.5 42.65,8.9 v42.54,9.01 | v39.87,15.11 IC4.5
  Bottom 0.254: v42.54,9.01 42.54,12.44 v39.87,15.11
N$70
  Top 0.254: R2.3 43.45,9.15 43.68,9.39 43.68,15.74 43.05,16.38 IC4.6
N$71
  Top 0.254: R2.1 44.24,17.08 43.68,17.64 IC4.7
N$72  (via drill 0.33)
  Top 0.254: Q4.2 46.85,44.31 47.36,43.81 v49.14,43.81 | v48.12,6.21 44.41,6.21 R2.2 | R12.4 44.72,43.45 v44.95,43.68
  Bottom 0.254: v48.12,6.21 49.52,7.61 49.52,43.43 v49.14,43.81 49.01,43.68 v44.95,43.68
N$73  (via drill 0.33)
  Top 0.254: Q4.5 46.85,46.85 47.49,47.49 v49.4,47.49 | v48.12,1.77 46.85,1.77 43.45,5.18 R2.4 | R12.2 43.61,44.24 v43.68,44.31
  Bottom 0.254: v48.12,1.77 48.12,4.95 50.03,6.85 50.03,46.85 v49.4,47.49 46.85,47.49 v43.68,44.31
N$74  (via drill 0.33)
  Top 0.254: Q3.2 46.85,38.6 | 46.85,38.6 47.49,37.97 v47.74,37.97 | v42.66,3.67 42.66,6.03 R2.6 | R12.8 42.34,41.84 45.59,38.6 46.85,38.6
  Bottom 0.254: v47.74,37.97 47.74,37.84 48.51,37.08 48.38,8.37 43.68,3.67 v42.66,3.67
N$75  (via drill 0.33)
  Top 0.254: Q3.5 46.85,41.77 47.24,42.16 48.38,42.16 v48.76,41.77 | R2.8 41.84,2.46 v41.9,2.41 | R12.6 44.72,42.65 v44.95,42.41
  Bottom 0.254: v41.9,2.41 46.22,2.41 46.85,3.04 46.85,6.21 49.01,8.37 49.01,41.52 v48.76,41.77 48.12,42.41 v44.95,42.41
N$76  (via drill 0.33)
  Top 0.254: R3.1 18.84,47.56 24.63,41.77 32.88,41.77 v33.52,41.14
  Bottom 0.254: v33.52,41.14 36.06,41.14 36.7,40.51 ADD3.2
N$78  (via drill 0.33)
  Top 0.254: R3.7 18.35,49.96 18.91,49.4 v36.7,49.4
  Bottom 0.254: v36.7,49.4 ADD0.2
N$79  (via drill 0.33)
  Top 0.254: R3.5 18.52,49.16 20.82,46.85 32.88,46.85 v33.52,46.22
  Bottom 0.254: v33.52,46.22 36.06,46.22 36.7,45.59 ADD1.2
N$80  (via drill 0.33)
  Top 0.254: 33.9,38.6 v33.52,38.98 | v31.61,44.31 22.73,44.31 18.68,48.36 R3.3
  Bottom 0.254: ADD4.2 36.7,36.44 36.31,36.06 34.54,36.06 33.52,37.08 v33.52,38.98 33.52,39.23 31.61,41.14 v31.61,44.31
RESET  (via drill 0.33)
  Top 0.254: v42.41,24.63 U1.4
  Bottom 0.254: v42.41,24.63 42.41,47.26 ICSP.5
SCK  (via drill 0.33)
  Top 0.254: U1.10 v21.45,25.9 v15.74,25.9 | IC3.11 v21.45,32.88 v32.88,32.88 | v32.88,36.7 IC2.11 | v15.74,12.56 IC1.11 25.65,12.56 25.77,12.44 26.54,12.44 26.66,12.56 v31.61,12.56 | IC4.11 v31.61,16.38
  Bottom 0.254: v21.45,25.9 v21.45,32.88 | v32.88,32.88 v32.88,36.7 | v15.74,25.9 v15.74,12.56 | v31.61,16.38 v31.61,12.56
SCL/SCLK  (via drill 0.33)
  Top 0.254: v26.66,52.57 42.36,52.57 ICSP.3 | v27.17,27.17 U1.9 | v17.01,30.98 24,30.98 24.63,30.34 v26.54,30.34
  Bottom 0.254: v26.66,52.57 26.66,49.52 25.46,48.32 I2C.7 25.46,45.78 R11.2 25.9,45.59 26.54,44.95 v26.54,30.34 26.54,29.71 26.54,27.8 v27.17,27.17 | NEO.2 v17.01,30.98
SDA/MOSI  (via drill 0.33)
  Top 0.254: v29.2,51.81 40.58,51.81 ICSP.4 | v27.8,28.44 U1.7
  Bottom 0.254: v29.2,51.81 29.2,49.27 28.08,48.15 I2C.5 28,46.02 R10.2 27.17,44.31 27.17,31.61 27.8,30.98 v27.8,28.44
SER  (via drill 0.33)
  Top 0.254: IC1.14 v22.73,16.38 | v22.73,23.36 U1.12
  Bottom 0.254: v22.73,16.38 v22.73,23.36
VCC  (via drill 0.33)
  Top 0.254: IC3.10 v25.27,31.61 | R12.5 R12.3 | R13.7 R13.5 R13.3 R13.1 34.09,9.46 v33.52,10.03 | R12.5 R12.7 | v38.22,46.22 38.44,46 R12.1 R12.5
  Top 0.406: v33.52,53.84 33.66,53.7 v37.97,53.7 ICSP.2 | v30.34,43.05 R10.1 R11.1 | v25.27,39.23 IC3.16 19.55,39.34 C1.1 | IC2.10 v31.61,37.97 | v31.61,37.97 v28.44,37.97 | C2.1 18.91,19.45 IC1.16 v21.45,18.91 v25.27,18.91 30.13,18.91 C5.1 | C5.1 30.34,20.76 U1.1 | C5.1 30.77,19.13 32.25,17.64 IC4.10 v33.52,17.64 | C4.1 36.06,10.13 IC4.16 v33.52,10.03 | I2C.3 I2C.1 | C3.1 36.7,29.81 IC2.16 v31.61,30.34 | v31.61,37.97 32.25,37.97 | IC1.10 v21.45,11.29 | Q4.1 46.2,45.57 | 46.2,45.57 46.22,45.59 38.85,45.59 v38.22,46.22 | 46.2,45.57 47.49,45.57 | 47.49,45.57 50.4,45.57 50.66,45.84 52.95,45.84 v53.84,44.95 | v54.48,10.03 51.94,10.03 51.68,10.28 50.66,10.28 50.41,10.03 47.49,10.03 | 47.49,10.03 46.47,10.03 46.22,9.77 46.22,9.24 Q1.1 | Q1.4 47.51,10.04 47.49,10.03 | Q4.4 47.51,45.59 47.49,45.57 | Q3.1 46.2,40.11 46.6,40.51 47.49,40.51 | 47.49,40.51 50.41,40.51 50.54,40.63 53.71,40.63 v53.84,40.76 | Q3.4 47.51,40.52 47.49,40.51 | Q2.1 46.2,15.34 46.6,15.74 47.49,15.74 | 47.49,15.74 50.16,15.74 50.54,15.36 53.59,15.36 v53.84,15.11 | Q2.4 47.51,15.76 47.49,15.74
  Bottom 0.406: v33.52,53.84 33.52,51.13 I2C.2 I2C.1 | I2C.3 30.54,43.24 v30.34,43.05 | R11.1 v25.27,39.23 v25.27,31.61 v25.27,18.91 | v28.44,37.97 R10.1 | v33.52,17.64 v33.52,10.03 | ADD5.3 ADD4.3 | ADD4.3 ADD3.3 ADD2.3 ADD1.3 v38.22,46.22 | v38.22,46.22 ADD0.3 | ADD4.3 v38.22,46.22 | v38.22,46.22 38.22,53.45 v37.97,53.7 | v31.61,30.34 v31.61,37.97 | v21.45,11.29 v21.45,18.91 | v53.84,44.95 v53.84,40.76 v53.84,15.11 53.84,10.66 v54.48,10.03
XLAT  (via drill 0.33)
  Top 0.254: IC3.12 v28.44,34.16 29.71,35.42 IC2.12 | IC4.12 v28.44,15.11 | IC1.12 25.65,13.84 25.77,13.96 26.54,13.96 26.66,13.84 v28.44,13.84 | U1.3 v28.44,23.36
  Bottom 0.254: v28.44,34.16 28.57,34.03 28.57,28.06 28.44,27.93 v28.44,23.36 v28.44,15.11 v28.44,13.84

### Text on the board
bPlace: [01] 5V | [02] 5V | [03] 5V | [04] GND | [05] SDA | [06] GND | [07] SCL | [08] GND | [09] 3V3 | [10] 3V3 | RGB Matrix Backpack v2 | CC-BY-NC-SA 3.0 | Logos Electromechanical (c) 2014
bNames: 0 | 1 | 0 | 1